# Altium schematic sheet chip-arduino.SchDoc
size A4
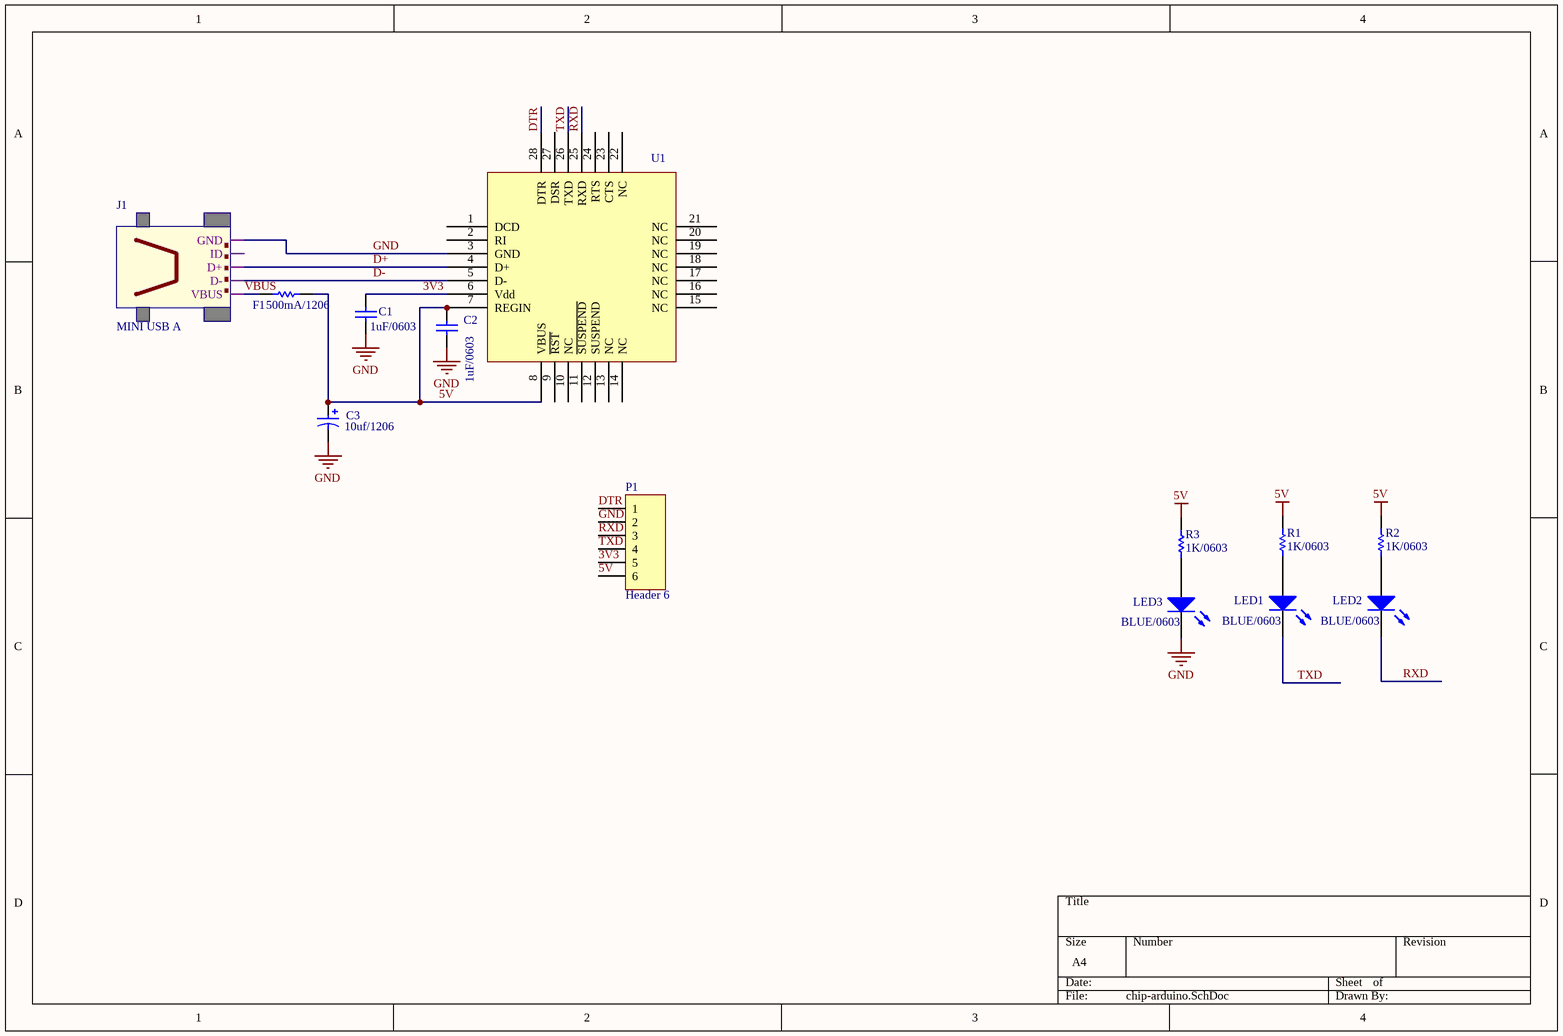
[diagram p0: chip-arduino.SchDoc]

## Parts
C1  1uF/0603  [C_0603]
C2  1uF/0603  [C_0603]
C3  value 10uf/1206  [C_1206]  (hidden comment: 10uF/10V)
F1  500mA/1206  [F_1206]
J1  MINI USB A  [MICRO USB DIP]
LED1  BLUE/0603  [LED_0603]
LED2  BLUE/0603  [LED_0603]
LED3  BLUE/0603  [LED_0603]
P1  Header 6  [HDR1X6]
R1  1K/0603  [R_0603]
R2  1K/0603  [R_0603]
R3  1K/0603  [R_0603]
U1  CP2102  [CP2102 QFN]  (value not drawn)

## Nets
5V: C2.2 C3.1 F1.1 P1.6 R1.2 R2.2 R3.2 U1.7(REGIN) U1.8(VBUS)
GND: C1.1 C2.1 C3.2 J1.GND LED3.2(K) P1.2 U1.3(GND)
3V3: C1.2 P1.5 U1.6(Vdd)
D+: J1.D+ U1.4(D+)
D-: J1.D- U1.5(D-)
DTR: P1.1 U1.28(DTR)
RXD: LED2.2(K) P1.3 U1.25(RXD)
TXD: LED1.2(K) P1.4 U1.26(TXD)
VBUS: F1.2 J1.VBUS
NetLED1_1: LED1.1(A) R1.1
NetLED2_1: LED2.1(A) R2.1
NetLED3_1: LED3.1(A) R3.1

Not connected (* = marked no-connect by the designer): J1 ID; U1 1(DCD) 2(RI) 9(~{RST}) 10(NC) 11(~{SUSPEND}) 12(SUSPEND) 13(NC) 14(NC) 15(NC) 16(NC) 17(NC) 18(NC) 19(NC) 20(NC) 21(NC) 22(NC) 23(CTS) 24(RTS) 27(DSR)

## Library data of the parts
C1 = Cap: Capacitor; Value: 100pF; Published: 8-Jun-2000; LatestRevisionDate: 17-Jul-2002; LatestRevisionNote: Re-released for DXP Platform.; PackageReference: RAD-0.3; Publisher: Altium Limited
C2 = Cap: Capacitor; Published: 8-Jun-2000; LatestRevisionDate: 17-Jul-2002; LatestRevisionNote: Re-released for DXP Platform.; PackageReference: RAD-0.3; Publisher: Altium Limited; Value: 1UF/0603
C3 = CAP2: Bi-Polar Capacitor
F1 R1-R3 = Res1: Resistor; Value: 1K; Published: 8-Jun-2000; LatestRevisionDate: 17-Jul-2002; LatestRevisionNote: Re-released for DXP Platform.; PackageReference: AXIAL-0.3; Publisher: Altium Limited
LED1-LED3 = LED2: Typical RED, GREEN, YELLOW, AMBER GaAs LED; Published: 8-Jun-2000; LatestRevisionDate: 17-Jul-2002; LatestRevisionNote: Re-released for DXP Platform.; PackageDocument: Feb-2002; PackageReference: 3.2X1.6X1.1; Publisher: Altium Limited
P1 = Header 6: Header, 6-Pin; LatestRevisionDate: 17-Jul-2002; LatestRevisionNote: Re-released for DXP Platform.; Publisher: Altium Limited
U1 = Component_1